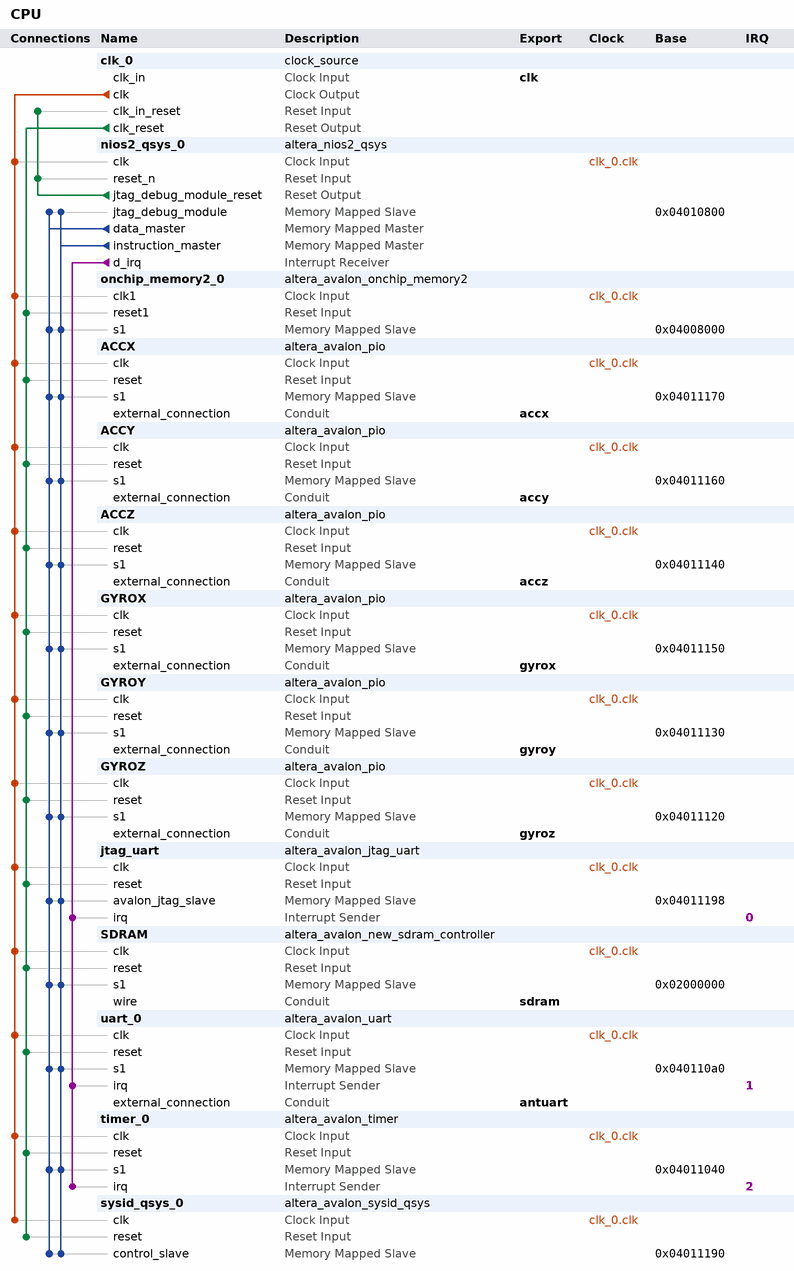
[diagram p0: system contents]
# Platform Designer (Qsys) system CPU, Cyclone IV E EP4CE22F17C6
# Parameters at their usual value, and those the tool derives, are not listed.
package require -exact qsys 13.1
create_system CPU
set_project_property DEVICE_FAMILY {Cyclone IV E}
set_project_property DEVICE EP4CE22F17C6

add_instance clk_0 clock_source 13.1
set_instance_parameter_value clk_0 clockFrequency 50000000

add_instance nios2_qsys_0 altera_nios2_qsys 13.1
set_instance_parameter_value nios2_qsys_0 muldiv_divider true
set_instance_parameter_value nios2_qsys_0 resetSlave SDRAM.s1
set_instance_parameter_value nios2_qsys_0 mmu_TLBMissExcSlave nios2_qsys_0.jtag_debug_module
set_instance_parameter_value nios2_qsys_0 exceptionSlave SDRAM.s1
set_instance_parameter_value nios2_qsys_0 breakSlave nios2_qsys_0.jtag_debug_module
set_instance_parameter_value nios2_qsys_0 impl Small
set_instance_parameter_value nios2_qsys_0 icache_size 4096
set_instance_parameter_value nios2_qsys_0 debug_level Level2

add_instance onchip_memory2_0 altera_avalon_onchip_memory2 13.1
set_instance_parameter_value onchip_memory2_0 dataWidth 32
set_instance_parameter_value onchip_memory2_0 dualPort false
set_instance_parameter_value onchip_memory2_0 initMemContent true
set_instance_parameter_value onchip_memory2_0 initializationFileName onchip_mem.hex
set_instance_parameter_value onchip_memory2_0 memorySize 26000

add_instance ACCX altera_avalon_pio 13.1
set_instance_parameter_value ACCX direction Input
set_instance_parameter_value ACCX width 16

add_instance ACCY altera_avalon_pio 13.1
set_instance_parameter_value ACCY direction Input
set_instance_parameter_value ACCY width 16

add_instance ACCZ altera_avalon_pio 13.1
set_instance_parameter_value ACCZ direction Input
set_instance_parameter_value ACCZ width 16

add_instance GYROX altera_avalon_pio 13.1
set_instance_parameter_value GYROX direction Input
set_instance_parameter_value GYROX width 16

add_instance GYROY altera_avalon_pio 13.1
set_instance_parameter_value GYROY direction Input
set_instance_parameter_value GYROY width 16

add_instance GYROZ altera_avalon_pio 13.1
set_instance_parameter_value GYROZ direction Input
set_instance_parameter_value GYROZ width 16

add_instance jtag_uart altera_avalon_jtag_uart 13.1
set_instance_parameter_value jtag_uart simInteractiveOptions NO_INTERACTIVE_WINDOWS

add_instance SDRAM altera_avalon_new_sdram_controller 13.1
set_instance_parameter_value SDRAM TAC 6.5
set_instance_parameter_value SDRAM TRCD 20.0
set_instance_parameter_value SDRAM TRP 20.0
set_instance_parameter_value SDRAM casLatency 2
set_instance_parameter_value SDRAM columnWidth 9
set_instance_parameter_value SDRAM dataWidth 16
set_instance_parameter_value SDRAM generateSimulationModel false
set_instance_parameter_value SDRAM initRefreshCommands 8
set_instance_parameter_value SDRAM model single_Micron_MT48LC4M32B2_7_chip
set_instance_parameter_value SDRAM numberOfBanks 4
set_instance_parameter_value SDRAM numberOfChipSelects 1
set_instance_parameter_value SDRAM powerUpDelay 200.0
set_instance_parameter_value SDRAM refreshPeriod 0.75
set_instance_parameter_value SDRAM rowWidth 13

add_instance uart_0 altera_avalon_uart 13.1
set_instance_parameter_value uart_0 baud 4800
set_instance_parameter_value uart_0 dataBits 8
set_instance_parameter_value uart_0 fixedBaud true
set_instance_parameter_value uart_0 parity NONE
set_instance_parameter_value uart_0 stopBits 1

add_instance timer_0 altera_avalon_timer 13.1
set_instance_parameter_value timer_0 counterSize 64
set_instance_parameter_value timer_0 period 1
set_instance_parameter_value timer_0 periodUnits MSEC

add_instance sysid_qsys_0 altera_avalon_sysid_qsys 13.1
set_instance_parameter_value sysid_qsys_0 id 286331153

# connections
add_connection clk_0.clk ACCX.clk clock
add_connection clk_0.clk ACCY.clk clock
add_connection clk_0.clk ACCZ.clk clock
add_connection clk_0.clk GYROX.clk clock
add_connection clk_0.clk GYROY.clk clock
add_connection clk_0.clk GYROZ.clk clock
add_connection clk_0.clk jtag_uart.clk clock
add_connection clk_0.clk nios2_qsys_0.clk clock
add_connection clk_0.clk onchip_memory2_0.clk1 clock
add_connection clk_0.clk SDRAM.clk clock
add_connection clk_0.clk sysid_qsys_0.clk clock
add_connection clk_0.clk timer_0.clk clock
add_connection clk_0.clk uart_0.clk clock
add_connection clk_0.clk_reset ACCX.reset reset
add_connection clk_0.clk_reset ACCY.reset reset
add_connection clk_0.clk_reset ACCZ.reset reset
add_connection clk_0.clk_reset GYROX.reset reset
add_connection clk_0.clk_reset GYROY.reset reset
add_connection clk_0.clk_reset GYROZ.reset reset
add_connection clk_0.clk_reset jtag_uart.reset reset
add_connection clk_0.clk_reset onchip_memory2_0.reset1 reset
add_connection clk_0.clk_reset SDRAM.reset reset
add_connection clk_0.clk_reset sysid_qsys_0.reset reset
add_connection clk_0.clk_reset timer_0.reset reset
add_connection clk_0.clk_reset uart_0.reset reset
add_connection nios2_qsys_0.jtag_debug_module_reset clk_0.clk_in_reset reset
add_connection nios2_qsys_0.jtag_debug_module_reset nios2_qsys_0.reset_n reset
add_connection nios2_qsys_0.data_master ACCX.s1 avalon
set_connection_parameter_value nios2_qsys_0.data_master/ACCX.s1 baseAddress 0x04011170
add_connection nios2_qsys_0.data_master ACCY.s1 avalon
set_connection_parameter_value nios2_qsys_0.data_master/ACCY.s1 baseAddress 0x04011160
add_connection nios2_qsys_0.data_master ACCZ.s1 avalon
set_connection_parameter_value nios2_qsys_0.data_master/ACCZ.s1 baseAddress 0x04011140
add_connection nios2_qsys_0.data_master GYROX.s1 avalon
set_connection_parameter_value nios2_qsys_0.data_master/GYROX.s1 baseAddress 0x04011150
add_connection nios2_qsys_0.data_master GYROY.s1 avalon
set_connection_parameter_value nios2_qsys_0.data_master/GYROY.s1 baseAddress 0x04011130
add_connection nios2_qsys_0.data_master GYROZ.s1 avalon
set_connection_parameter_value nios2_qsys_0.data_master/GYROZ.s1 baseAddress 0x04011120
add_connection nios2_qsys_0.data_master jtag_uart.avalon_jtag_slave avalon
set_connection_parameter_value nios2_qsys_0.data_master/jtag_uart.avalon_jtag_slave baseAddress 0x04011198
add_connection nios2_qsys_0.data_master nios2_qsys_0.jtag_debug_module avalon
set_connection_parameter_value nios2_qsys_0.data_master/nios2_qsys_0.jtag_debug_module baseAddress 0x04010800
add_connection nios2_qsys_0.data_master onchip_memory2_0.s1 avalon
set_connection_parameter_value nios2_qsys_0.data_master/onchip_memory2_0.s1 baseAddress 0x04008000
add_connection nios2_qsys_0.data_master SDRAM.s1 avalon
set_connection_parameter_value nios2_qsys_0.data_master/SDRAM.s1 baseAddress 0x02000000
add_connection nios2_qsys_0.data_master sysid_qsys_0.control_slave avalon
set_connection_parameter_value nios2_qsys_0.data_master/sysid_qsys_0.control_slave baseAddress 0x04011190
add_connection nios2_qsys_0.data_master timer_0.s1 avalon
set_connection_parameter_value nios2_qsys_0.data_master/timer_0.s1 baseAddress 0x04011040
add_connection nios2_qsys_0.data_master uart_0.s1 avalon
set_connection_parameter_value nios2_qsys_0.data_master/uart_0.s1 baseAddress 0x040110a0
add_connection nios2_qsys_0.instruction_master ACCX.s1 avalon
set_connection_parameter_value nios2_qsys_0.instruction_master/ACCX.s1 baseAddress 0x04011170
add_connection nios2_qsys_0.instruction_master ACCY.s1 avalon
set_connection_parameter_value nios2_qsys_0.instruction_master/ACCY.s1 baseAddress 0x04011160
add_connection nios2_qsys_0.instruction_master ACCZ.s1 avalon
set_connection_parameter_value nios2_qsys_0.instruction_master/ACCZ.s1 baseAddress 0x04011140
add_connection nios2_qsys_0.instruction_master GYROX.s1 avalon
set_connection_parameter_value nios2_qsys_0.instruction_master/GYROX.s1 baseAddress 0x04011150
add_connection nios2_qsys_0.instruction_master GYROY.s1 avalon
set_connection_parameter_value nios2_qsys_0.instruction_master/GYROY.s1 baseAddress 0x04011130
add_connection nios2_qsys_0.instruction_master GYROZ.s1 avalon
set_connection_parameter_value nios2_qsys_0.instruction_master/GYROZ.s1 baseAddress 0x04011120
add_connection nios2_qsys_0.instruction_master jtag_uart.avalon_jtag_slave avalon
set_connection_parameter_value nios2_qsys_0.instruction_master/jtag_uart.avalon_jtag_slave baseAddress 0x04011198
add_connection nios2_qsys_0.instruction_master nios2_qsys_0.jtag_debug_module avalon
set_connection_parameter_value nios2_qsys_0.instruction_master/nios2_qsys_0.jtag_debug_module baseAddress 0x04010800
add_connection nios2_qsys_0.instruction_master onchip_memory2_0.s1 avalon
set_connection_parameter_value nios2_qsys_0.instruction_master/onchip_memory2_0.s1 baseAddress 0x04008000
add_connection nios2_qsys_0.instruction_master SDRAM.s1 avalon
set_connection_parameter_value nios2_qsys_0.instruction_master/SDRAM.s1 baseAddress 0x02000000
add_connection nios2_qsys_0.instruction_master sysid_qsys_0.control_slave avalon
set_connection_parameter_value nios2_qsys_0.instruction_master/sysid_qsys_0.control_slave baseAddress 0x04011190
add_connection nios2_qsys_0.instruction_master timer_0.s1 avalon
set_connection_parameter_value nios2_qsys_0.instruction_master/timer_0.s1 baseAddress 0x04011040
add_connection nios2_qsys_0.instruction_master uart_0.s1 avalon
set_connection_parameter_value nios2_qsys_0.instruction_master/uart_0.s1 baseAddress 0x040110a0
add_connection nios2_qsys_0.d_irq jtag_uart.irq interrupt
set_connection_parameter_value nios2_qsys_0.d_irq/jtag_uart.irq irqNumber 0
add_connection nios2_qsys_0.d_irq timer_0.irq interrupt
set_connection_parameter_value nios2_qsys_0.d_irq/timer_0.irq irqNumber 2
add_connection nios2_qsys_0.d_irq uart_0.irq interrupt
set_connection_parameter_value nios2_qsys_0.d_irq/uart_0.irq irqNumber 1

# exported interfaces
add_interface clk clock sink
set_interface_property clk EXPORT_OF clk_0.clk_in
add_interface accx conduit end
set_interface_property accx EXPORT_OF ACCX.external_connection
add_interface accy conduit end
set_interface_property accy EXPORT_OF ACCY.external_connection
add_interface accz conduit end
set_interface_property accz EXPORT_OF ACCZ.external_connection
add_interface gyroy conduit end
set_interface_property gyroy EXPORT_OF GYROY.external_connection
add_interface gyrox conduit end
set_interface_property gyrox EXPORT_OF GYROX.external_connection
add_interface gyroz conduit end
set_interface_property gyroz EXPORT_OF GYROZ.external_connection
add_interface sdram conduit end
set_interface_property sdram EXPORT_OF SDRAM.wire
add_interface antuart conduit end
set_interface_property antuart EXPORT_OF uart_0.external_connection

set_interconnect_requirement {$system} qsys_mm.clockCrossingAdapter HANDSHAKE
set_interconnect_requirement {$system} qsys_mm.maxAdditionalLatency 1
set_interconnect_requirement {$system} qsys_mm.insertDefaultSlave false

save_system CPU.qsys
